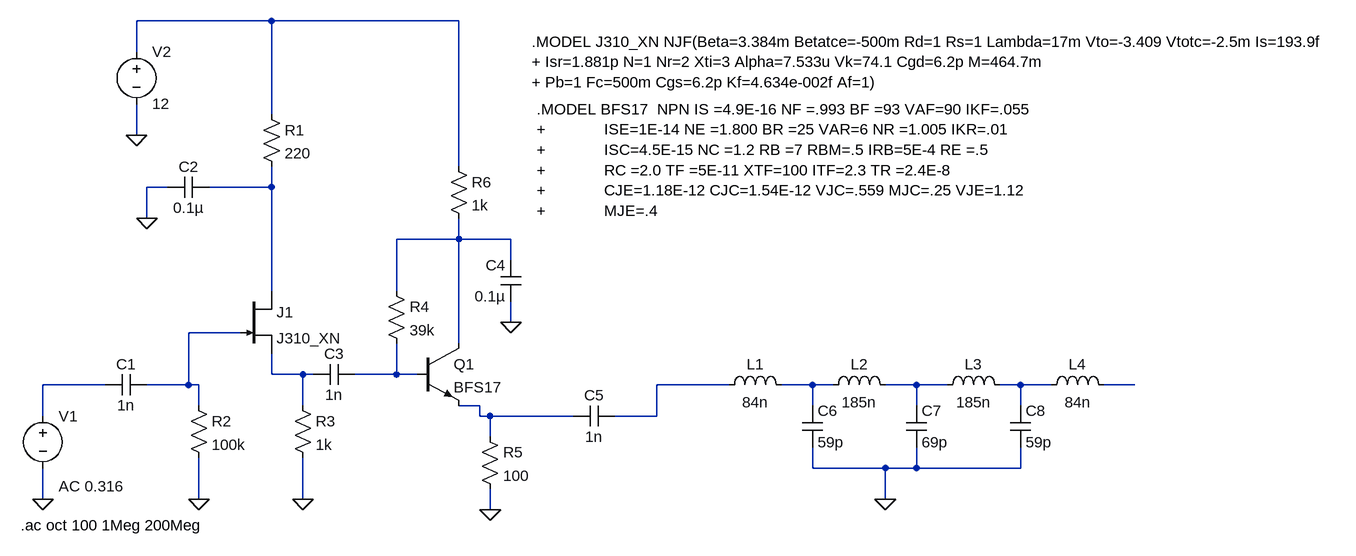
[diagram p0: schematic circuit.asc]
circuit.asc, the LTspice schematic file:
Version 4
SHEET 1 1924 680
WIRE 272 -432 64 -432
WIRE 560 -432 272 -432
WIRE 64 -384 64 -432
WIRE 272 -288 272 -432
WIRE 64 -256 64 -304
WIRE 560 -208 560 -432
WIRE 112 -176 80 -176
WIRE 272 -176 272 -208
WIRE 272 -176 176 -176
WIRE 80 -128 80 -176
WIRE 560 -96 560 -128
WIRE 560 -96 464 -96
WIRE 640 -96 560 -96
WIRE 640 -64 640 -96
WIRE 272 -16 272 -176
WIRE 464 -16 464 -96
WIRE 640 32 640 0
WIRE 224 48 144 48
WIRE 560 64 560 -96
WIRE 272 112 272 80
WIRE 320 112 272 112
WIRE 336 112 320 112
WIRE 464 112 464 64
WIRE 464 112 400 112
WIRE 496 112 464 112
WIRE 16 128 -80 128
WIRE 144 128 144 48
WIRE 144 128 80 128
WIRE 160 128 144 128
WIRE 976 128 864 128
WIRE 1104 128 1056 128
WIRE 1136 128 1104 128
WIRE 1264 128 1216 128
WIRE 1312 128 1264 128
WIRE 1424 128 1392 128
WIRE 1472 128 1424 128
WIRE 1600 128 1552 128
WIRE 160 160 160 128
WIRE 320 160 320 112
WIRE 592 160 560 160
WIRE 1104 160 1104 128
WIRE 1264 160 1264 128
WIRE 1424 160 1424 128
WIRE -80 176 -80 128
WIRE 592 176 592 160
WIRE 608 176 592 176
WIRE 736 176 608 176
WIRE 864 176 864 128
WIRE 864 176 800 176
WIRE 608 208 608 176
WIRE 1104 256 1104 224
WIRE 1216 256 1104 256
WIRE 1264 256 1264 224
WIRE 1264 256 1216 256
WIRE 1424 256 1424 224
WIRE 1424 256 1264 256
WIRE -80 304 -80 256
WIRE 160 304 160 240
WIRE 320 304 320 240
WIRE 1216 304 1216 256
WIRE 608 320 608 288
FLAG -80 304 0
FLAG 160 304 0
FLAG 320 304 0
FLAG 608 320 0
FLAG 1216 304 0
FLAG 64 -256 0
FLAG 80 -128 0
FLAG 640 32 0
SYMBOL voltage -80 160 R0
WINDOW 123 24 124 Left 2
WINDOW 39 0 0 Left 2
SYMATTR InstName V1
SYMATTR Value ""
SYMATTR Value2 AC 0.316
SYMBOL cap 80 112 R90
WINDOW 0 0 32 VBottom 2
WINDOW 3 32 32 VTop 2
SYMATTR InstName C1
SYMATTR Value 1n
SYMBOL cap 176 -192 R90
WINDOW 0 0 32 VBottom 2
WINDOW 3 32 32 VTop 2
SYMATTR InstName C2
SYMATTR Value 0.1µ
SYMBOL cap 400 96 R90
WINDOW 0 0 32 VBottom 2
WINDOW 3 32 32 VTop 2
SYMATTR InstName C3
SYMATTR Value 1n
SYMBOL cap 656 0 R180
WINDOW 0 24 56 Left 2
WINDOW 3 24 8 Left 2
SYMATTR InstName C4
SYMATTR Value 0.1µ
SYMBOL cap 736 192 R270
WINDOW 0 32 32 VTop 2
WINDOW 3 0 32 VBottom 2
SYMATTR InstName C5
SYMATTR Value 1n
SYMBOL cap 1088 160 R0
SYMATTR InstName C6
SYMATTR Value 59p
SYMBOL cap 1248 160 R0
SYMATTR InstName C7
SYMATTR Value 69p
SYMBOL cap 1408 160 R0
SYMATTR InstName C8
SYMATTR Value 59p
SYMBOL ind 960 144 R270
WINDOW 0 32 56 VTop 2
WINDOW 3 5 56 VBottom 2
SYMATTR InstName L1
SYMATTR Value 84n
SYMBOL ind 1120 144 R270
WINDOW 0 32 56 VTop 2
WINDOW 3 5 56 VBottom 2
SYMATTR InstName L2
SYMATTR Value 185n
SYMBOL ind 1296 144 R270
WINDOW 0 32 56 VTop 2
WINDOW 3 5 56 VBottom 2
SYMATTR InstName L3
SYMATTR Value 185n
SYMBOL njf 224 -16 R0
SYMATTR InstName J1
SYMATTR Value J310_XN
SYMBOL npn 496 64 R0
SYMATTR InstName Q1
SYMATTR Value BFS17
SYMBOL voltage 64 -400 R0
WINDOW 123 0 0 Left 2
WINDOW 39 0 0 Left 2
SYMATTR InstName V2
SYMATTR Value 12
SYMBOL res 256 -304 R0
SYMATTR InstName R1
SYMATTR Value 220
SYMBOL res 144 144 R0
SYMATTR InstName R2
SYMATTR Value 100k
SYMBOL res 304 144 R0
SYMATTR InstName R3
SYMATTR Value 1k
SYMBOL res 448 -32 R0
SYMATTR InstName R4
SYMATTR Value 39k
SYMBOL res 592 192 R0
SYMATTR InstName R5
SYMATTR Value 100
SYMBOL res 544 -224 R0
SYMATTR InstName R6
SYMATTR Value 1k
SYMBOL ind 1456 144 R270
WINDOW 0 32 56 VTop 2
WINDOW 3 5 56 VBottom 2
SYMATTR InstName L4
SYMATTR Value 84n
TEXT 672 -400 Left 2 !.MODEL J310_XN NJF(Beta=3.384m Betatce=-500m Rd=1 Rs=1 Lambda=17m Vto=-3.409 Vtotc=-2.5m Is=193.9f \n+ Isr=1.881p N=1 Nr=2 Xti=3 Alpha=7.533u Vk=74.1 Cgd=6.2p M=464.7m \n+ Pb=1 Fc=500m Cgs=6.2p Kf=4.634e-002f Af=1)
TEXT 680 -296 Left 2 !.MODEL BFS17  NPN IS =4.9E-16 NF =.993 BF =93 VAF=90 IKF=.055 \n+             ISE=1E-14 NE =1.800 BR =25 VAR=6 NR =1.005 IKR=.01 \n+             ISC=4.5E-15 NC =1.2 RB =7 RBM=.5 IRB=5E-4 RE =.5 \n+             RC =2.0 TF =5E-11 XTF=100 ITF=2.3 TR =2.4E-8 \n+             CJE=1.18E-12 CJC=1.54E-12 VJC=.559 MJC=.25 VJE=1.12 \n+             MJE=.4
TEXT -114 344 Left 2 !.ac oct 100 1Meg 200Meg

The netlist it stands for:
* circuit.asc
V1 N007 0 AC 0.316
C1 N004 N007 1n
C2 N002 0 0.1µ
C3 N006 N005 1n
C4 0 N003 0.1µ
C5 N013 N008 1n
C6 N009 0 59p
C7 N010 0 69p
C8 N011 0 59p
L1 N008 N009 84n
L2 N009 N010 185n
L3 N010 N011 185n
J1 N002 N004 N005 J310_XN
Q1 N003 N006 N013 0 BFS17
V2 N001 0 12
R1 N001 N002 220
R2 N004 0 100k
R3 N005 0 1k
R4 N003 N006 39k
R5 N013 0 100
R6 N001 N003 1k
L4 N011 N012 84n
.model NPN NPN
.model PNP PNP
.lib standard.bjt
.model NJF NJF
.model PJF PJF
.lib standard.jft
.MODEL J310_XN NJF(Beta=3.384m Betatce=-500m Rd=1 Rs=1 Lambda=17m Vto=-3.409 Vtotc=-2.5m Is=193.9f
+ Isr=1.881p N=1 Nr=2 Xti=3 Alpha=7.533u Vk=74.1 Cgd=6.2p M=464.7m
+ Pb=1 Fc=500m Cgs=6.2p Kf=4.634e-002f Af=1)
.MODEL BFS17  NPN IS =4.9E-16 NF =.993 BF =93 VAF=90 IKF=.055
+             ISE=1E-14 NE =1.800 BR =25 VAR=6 NR =1.005 IKR=.01
+             ISC=4.5E-15 NC =1.2 RB =7 RBM=.5 IRB=5E-4 RE =.5
+             RC =2.0 TF =5E-11 XTF=100 ITF=2.3 TR =2.4E-8
+             CJE=1.18E-12 CJC=1.54E-12 VJC=.559 MJC=.25 VJE=1.12
+             MJE=.4
.ac oct 100 1Meg 200Meg
.backanno
.end